# EAGLE design esp32s2Stick (EAGLE 9.6.2)
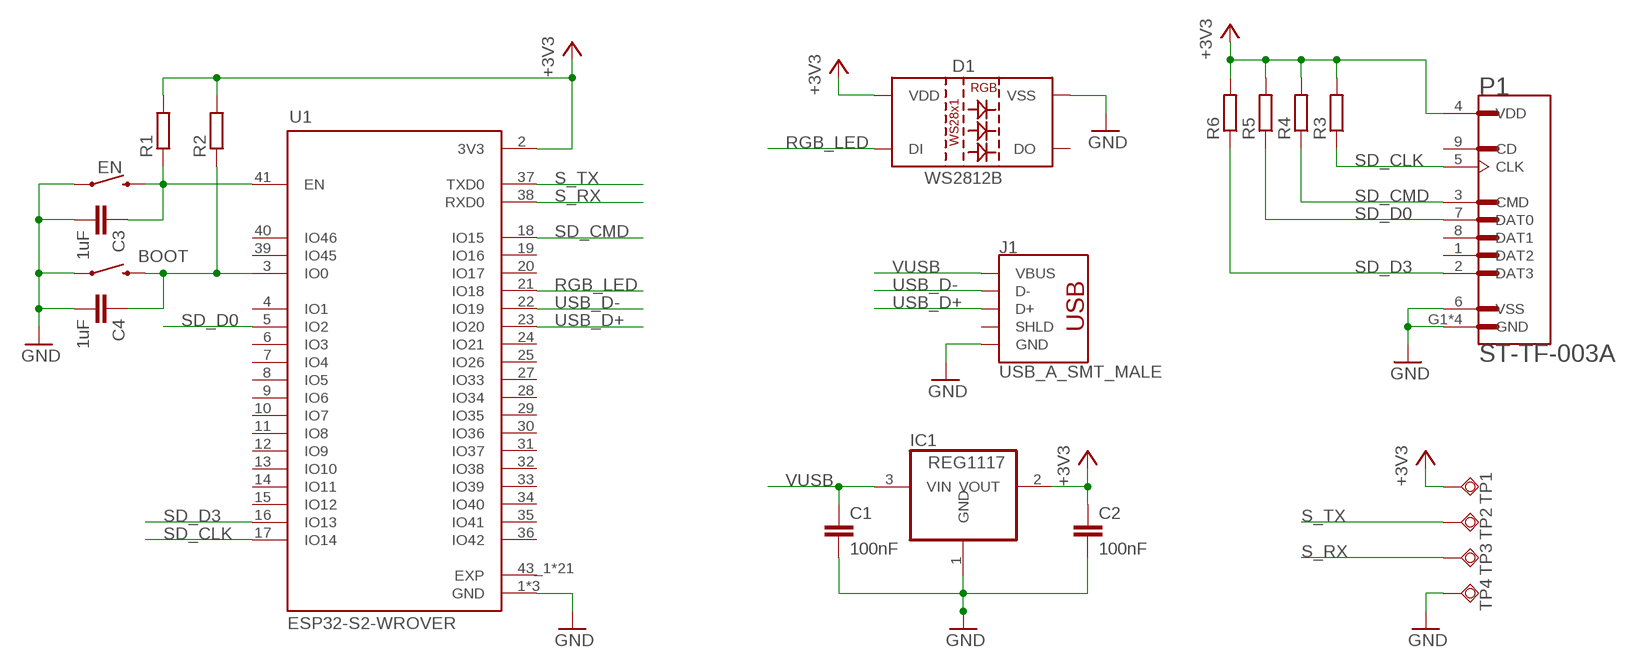
[diagram p0: schematic, sheet 1]

## Parts
BOOT  MOMENTARY-SWITCH-SPST-SMD-5.2MM  [TACTILE_SWITCH_SMD_5.2MM]
C1  100nF  C-EUC0805  [C0805]
C2  100nF  C-EUC0805  [C0805]
C3  1uF  C-EUC0805  [C0805]
C4  1uF  C-EUC0805  [C0805]
D1  WS2812B  [WS2812B]
EN  MOMENTARY-SWITCH-SPST-SMD-5.2MM  [TACTILE_SWITCH_SMD_5.2MM]
IC1  REG1117  [SOT223]
J1  USB_A_SMT_MALE  [USB-A-SMT-MALE]
P1  ST-TF-003A  [SUNTECH_ST-TF-003A]
R1  R-EU_R0603  [R0603]
R2  R-EU_R0603  [R0603]
R3  R-EU_R0603  [R0603]
R4  R-EU_R0603  [R0603]
R5  R-EU_R0603  [R0603]
R6  R-EU_R0603  [R0603]
TP1  TPSQTP15R  [TP15R]
TP2  TPSQTP15R  [TP15R]
TP3  TPSQTP15R  [TP15R]
TP4  TPSQTP15R  [TP15R]
U1  ESP32-S2-WROVER  [MODULE_ESP32-S2-WROVER]

## Nets
+3V3: C2.1 D1.1(VDD) IC1.2(VOUT) P1.4(VDD) R1.2 R2.2 R3.2 R4.2 R5.2 R6.2 TP1.TP U1.2(3V3)
GND: BOOT.1 C1.2 C2.2 C3.2 C4.2 D1.3(VSS) EN.1 IC1.1(GND) J1.GND1(GND) P1.6(VSS) P1.G1(GND) P1.G2(GND) P1.G3(GND) P1.G4(GND) TP4.TP U1.1(GND) U1.26(GND) U1.42(GND)
N$1: BOOT.3 C4.1 R2.1 U1.3(IO0)
N$2: C3.1 EN.3 R1.1 U1.41(EN)
RGB_LED: D1.4(DI) U1.21(IO18)
S_RX: TP3.TP U1.38(RXD0)
S_TX: TP2.TP U1.37(TXD0)
SD_CLK: P1.5(CLK) R3.1 U1.17(IO14)
SD_CMD: P1.3(CMD) R4.1 U1.18(IO15)
SD_D0: P1.7(DAT0) R5.1 U1.5(IO2)
SD_D3: P1.2(DAT3) R6.1 U1.16(IO13)
USB_D+: J1.D+1(D+) U1.23(IO20)
USB_D-: J1.D-1(D-) U1.22(IO19)
VUSB: C1.1 IC1.3(VIN) J1.VBUS1(VBUS)
Unconnected: D1.2(DO) J1.SHLD1(SHLD) J1.SHLD2(SHLD) P1.1(DAT2) P1.8(DAT1) P1.9(CD) U1.4(IO1) U1.6(IO3) U1.7(IO4) U1.8(IO5) U1.9(IO6) U1.10(IO7) U1.11(IO8) U1.12(IO9) U1.13(IO10) U1.14(IO11) U1.15(IO12) U1.19(IO16) U1.20(IO17) U1.24(IO21) U1.25(IO26) U1.27(IO33) U1.28(IO34) U1.29(IO35) U1.30(IO36) U1.31(IO37) U1.32(IO38) U1.33(IO39) U1.34(IO40) U1.35(IO41) U1.36(IO42) U1.39(IO45) U1.40(IO46)

## Power pins joined to a net without a drawn wire
EXP: U1.43_1(EXP) U1.43_2(EXP) U1.43_3(EXP) U1.43_4(EXP) U1.43_5(EXP) U1.43_6(EXP) U1.43_7(EXP) U1.43_8(EXP) U1.43_9(EXP) U1.43_10(EXP) U1.43_11(EXP) U1.43_12(EXP) U1.43_13(EXP) U1.43_14(EXP) U1.43_15(EXP) U1.43_16(EXP) U1.43_17(EXP) U1.43_18(EXP) U1.43_19(EXP) U1.43_20(EXP) U1.43_21(EXP)

## Library data of the parts
BOOT EN = SparkFun-Switches:MOMENTARY-SWITCH-SPST: Momentary Switch (Pushbutton) - SPST Normally-open (NO) SPST momentary switches (buttons, pushbuttons). Variants PTH-12MM - 12mm square, through-hole Momentary Pushbutton Switch - 12mm Square <https://www.sparkfun.com/products/9190> (COM-09190) PTH-6.0MM, PTH-6.0MM-KIT - 6.0mm square, through-hole Mini Pushbutton Switch <https://www.sparkfun.com/products/97> (COM-00097) KIT package intended for soldering kit's - only one side of pads' copper is exposed. PTH-RIGHT-ANGLE-KIT - Right-angle, through-hole Right Angle Tactile Button <https://www.sparkfun.com/products/10791> - Used on SparkFun BigTime Watch Kit <https://www.sparkfun.com/products/11734> SMD-12MM - 12mm square, surface-mount Tactile Button - SMD (12mm) <https://www.sparkfun.com/products/12993> (COM-12993) Used on SparkFun PicoBoard <https://www.sparkfun.com/products/11888> SMD-4.5MM - 4.5mm Square Trackball Switch Used on SparkFun Blackberry Trackballer Breakout <https://www.sparkfun.com/products/13169> SMD-4.6MMX2.8MM - 4.60mm x 2.80mm, surface mount Used on SparkFun SAMD21 Mini Breakout <https://www.sparkfun.com/products/13664> SMD-5.2MM, SMD-5.2-REDUNDANT - 5.2mm square, surface-mount Mini Pushbutton Switch - SMD <https://www.sparkfun.com/products/8720> (COM-08720) Used on Arduino Pro Mini <https://www.sparkfun.com/products/11114> REDUNDANT package connects both switch circuits together SMD-6.0X3.5MM - 6.0 x 3.5mm, surface mount Momentary Reset Switch SMD <https://www.sparkfun.com/products/8229> (COM-08229) SMD-6.2MM-TALL - 6.2mm square, surface mount Tactile Button - SMD (6mm) <https://www.sparkfun.com/products/12992> Used on SparkFun Digital Sandbox <https://www.sparkfun.com/products/12651> SMD-RIGHT-ANGLE - Right-angle, surface mount Used on SparkFun Block for Intel® Edison - Arduino <https://www.sparkfun.com/products/13036>; PROD_ID: SWCH-08247; SF_SKU: COM-08720
C1-C4 = rcl:C-EU: CAPACITOR, European symbol; SPICEPREFIX: C
D1 = SparkFun-LED:WS2812B: WS2812B SMD addressable RGB LED 5x5mm SMD LED with built-in controller IC. Color: Red/Green/Blue mC Rating: RGB: 390, 660, 180 mcd Forward Voltage: RGB: 2.0, 3.0, 3.0 V Packages:WS2812B SparkFun Products: Blynk Board - ESP8266 <https://www.sparkfun.com/products/13794>; PROD_ID: DIO-12503
IC1 = burr-brown:REG1117: 800mA and 1A Low Dropout (LDO) Positive Regulator 1.8V, 2.5V, 2.85V, 3.3V, 5V, and Adj; MPN: REG1117; OC_FARNELL: 1097566; OC_NEWARK: 14P6981
J1 = SparkFun-Connectors:USB_A: USB-A Connector Male and female variants, as well as PTH and SMT variants SparkFun Products: SparkFun XBee Explorer Dongle <https://www.sparkfun.com/products/11697> PTH Male SparkFun MicroView-USB Programmer <https://www.sparkfun.com/products/12924> SMT Male SparkFun USB Type A Female Breakout <https://www.sparkfun.com/products/12700> SMT Female; PROD_ID: CONN-11499
P1 = ST-TF-003A:ST-TF-003A: Micro SD Card Socket; AVAILABILITY: Unavailable; DESCRIPTION: Micro SD Card Socket; MF: Suntech; MP: ST-TF-003A; PACKAGE: None; PRICE: None
R1-R6 = rcl:R-EU_: RESISTOR, European symbol; SPICEPREFIX: R
TP1-TP4 = testpad:TPSQ: Test pad
U1 = ESP32-S2-WROVER:ESP32-S2-WROVER: WiFi 802.11b/g/n Transceiver Module 2.4GHz Antenna Not Included Surface Mount Check prices <https://pricing.snapeda.com/parts/ESP32-S2-WROVER/Espressif%20Systems/view-part?ref=eda>; AVAILABILITY: Bad; DESCRIPTION: WiFi 802.11b/g/n Transceiver Module 2.4GHz Antenna Not Included Surface Mount; MF: Espressif Systems; MP: ESP32-S2-WROVER; PACKAGE: VFQFN-56 Espressif Systems; PRICE: None

## Board
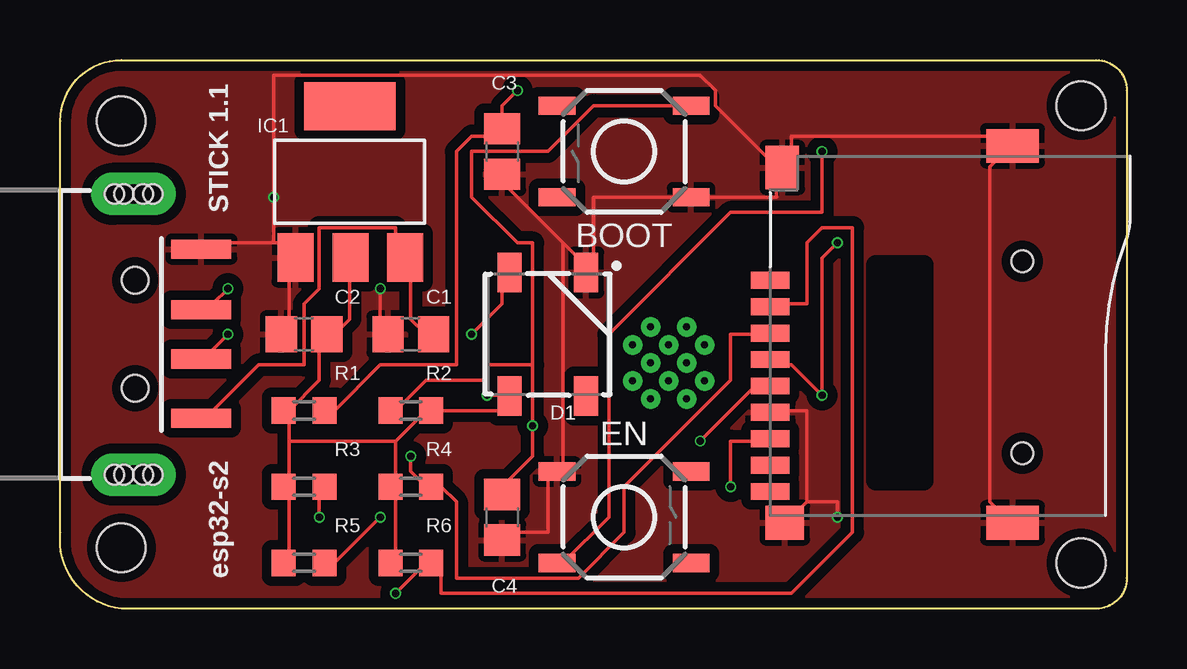
[diagram p1: board, top side]
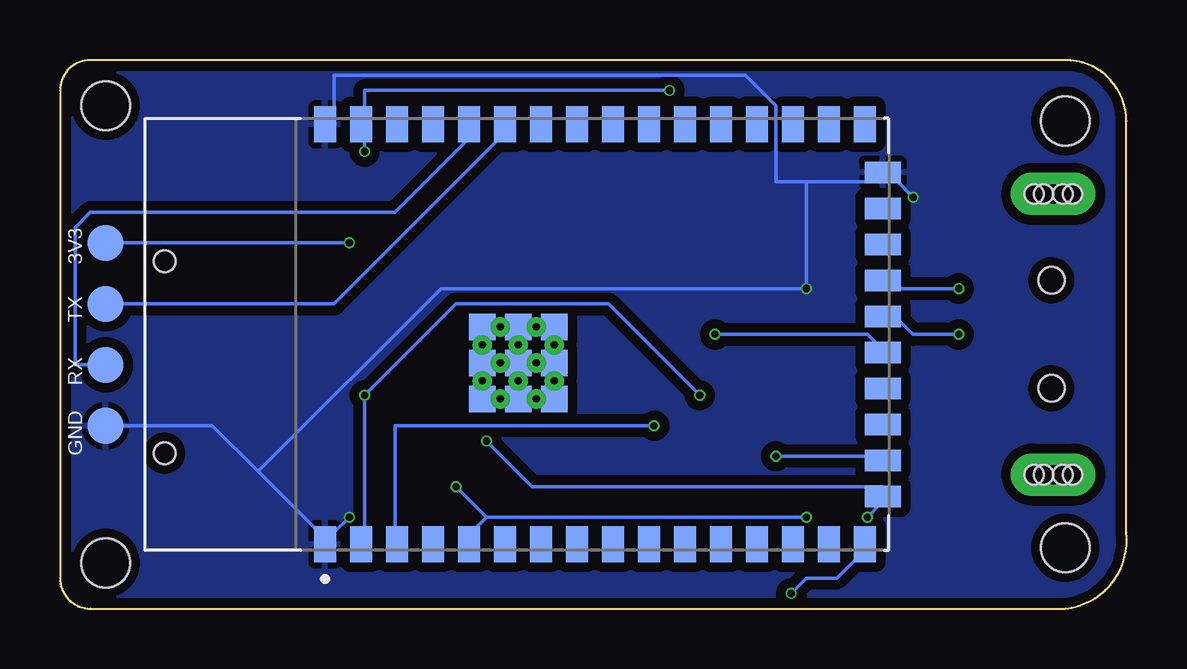
[diagram p2: board, bottom side, seen from below]

Size 44.47 x 22.86 mm. Coordinates in mm from the lower left corner, seen from the top.
Outline: 0.02,20.32 arc-90 2.56,22.86 43.2,22.86 arc-90 44.47,21.59 44.47,1.27 arc-90 43.2,0 2.56,0 arc-90 0.02,3.17 0.02,20.32
Copper layers (1*16): Top 0.035mm / dielectric 1.6mm / Bottom 0.035mm
Design rules "jlcpcb-2layers *": minimum track width 6mil, minimum drill 0.3mm, track to track 6mil, track to pad 6mil, pad to pad 6mil, via to via 6mil, smd to smd 6mil, copper to edge 0.2mm, drill to drill 6mil, minimum pad ring 10mil, minimum via ring 3mil, stop-mask expansion 4mil, vias tented up to drill 0mil, thermal gap 10mil
Holes 2.03 mm at 2.56,20.32 2.56,2.54 42.56,20.95 42.56,1.91

### Footprints (pad centres in the part's own frame; a part is rotated, then mirrored left to right if it is on the bottom)
TACTILE_SWITCH_SMD_5.2MM = smd 1.524 x 0.762: 1 -2.794,1.905; 2 2.794,1.905; 3 -2.794,-1.905; 4 2.794,-1.905
C0805 = smd 1.3 x 1.5: 1 -0.95,0; 2 0.95,0
WS2812B = smd 1.651 x 1: 1 2.577,-1.6; 2 2.577,1.6; 3 -2.577,1.6; 4 -2.577,-1.6
SOT223 = smd 1.499 x 2.007: 1 -2.261,-3.15; 2 0.025,-3.15; 3 2.311,-3.15 | smd 3.81 x 2.007: 4 0,3.15
USB-A-SMT-MALE = smd 2.5 x 0.8: D+1 10.95,1.027; D-1 10.95,-1.027; GND1 10.95,3.551; VBUS1 10.95,-3.5 | drill 0.8 pad 1.778 long: SHLD1 8.13,-5.85; SHLD2 8.13,5.85 | hole 1.1: 8.2,2.25; 8.2,-2.25 | hole 0.8: 8.53,-5.85; 8.93,-5.85; 7.73,-5.85; 7.33,-5.85; 8.53,5.85; 8.93,5.85; 7.73,5.85; 7.33,5.85
SUNTECH_ST-TF-003A = smd 0.7 x 1.6: 1 3.52,5.33; 2 2.42,5.33; 3 1.32,5.33; 4 0.22,5.33; 5 -0.88,5.33; 6 -1.98,5.33; 7 -3.08,5.33; 8 -4.18,5.33; 9 -5.28,5.33 | smd 1.4 x 1.6: G1 -6.58,4.73 | smd 1.4 x 2.2: G2 -6.58,-4.77; G3 9.12,-4.77 | smd 1.8 x 1.4: G4 8.22,4.83 | hole 0.9: -3.68,-5.17; 4.32,-5.17
R0603 = smd 1 x 1.1: 1 -0.85,0; 2 0.85,0
TP15R = smd 1.5 x 1.5: TP 0,0
MODULE_ESP32-S2-WROVER = smd 1.5 x 0.9: 1 -8.75,8; 2 -8.75,6.5; 3 -8.75,5; 4 -8.75,3.5; 5 -8.75,2; 6 -8.75,0.5; 7 -8.75,-1; 8 -8.75,-2.5; 9 -8.75,-4; 10 -8.75,-5.5; 11 -8.75,-7; 12 -8.75,-8.5; 13 -8.75,-10; 14 -8.75,-11.5; 15 -8.75,-13; 16 -8.75,-14.5; 27 8.75,-14.5; 28 8.75,-13; 29 8.75,-11.5; 30 8.75,-10; 31 8.75,-8.5; 32 8.75,-7; 33 8.75,-5.5; 34 8.75,-4; 35 8.75,-2.5; 36 8.75,-1; 37 8.75,0.5; 38 8.75,2; 39 8.75,3.5; 40 8.75,5; 41 8.75,6.5; 42 8.75,8 | smd 0.9 x 1.5: 17 -6.75,-15.25; 18 -5.25,-15.25; 19 -3.75,-15.25; 20 -2.25,-15.25; 21 -0.75,-15.25; 22 0.75,-15.25; 23 2.25,-15.25; 24 3.75,-15.25; 25 5.25,-15.25; 26 6.75,-15.25 | smd 1.1 x 1.1: 43_1 -2.69,1.45; 43_2 -1.19,1.45; 43_3 0.31,1.45; 43_4 -2.69,-0.05; 43_5 -1.19,-0.05; 43_6 0.31,-0.05; 43_7 -2.69,-1.55; 43_8 -1.19,-1.55; 43_9 0.31,-1.55 | drill 0.3 pad 0.406: 43_10 -1.94,1.45; 43_11 -0.44,1.45; 43_12 -2.69,0.7; 43_13 -1.19,0.7; 43_14 0.31,0.7; 43_15 -1.94,-0.05; 43_16 -0.44,-0.05; 43_17 -2.69,-0.8; 43_18 -1.19,-0.8; 43_19 0.31,-0.8; 43_20 -1.94,-1.55; 43_21 -0.44,-1.55

### Placement (x,y rotation side)
BOOT  23.51,19.05 180 top
C1  14.62,11.43 180 top
C2  10.18,11.43 180 top
C3  18.43,19.05 270 top
C4  18.43,3.81 270 top
D1  20.34,11.43 270 top
EN  23.51,3.81 0 top
IC1  12.08,17.78 0 top
J1  -5.06,11.43 0 top
P1  34.94,10.16 90 top
R1  10.18,8.26 180 top
R2  14.62,8.26 0 top
R3  10.18,5.08 180 top
R4  14.62,5.08 180 top
R5  10.18,1.91 180 top
R6  14.62,1.91 180 top
TP1  42.56,15.24 0 bottom
TP2  42.56,12.7 0 bottom
TP3  42.56,10.16 0 bottom
TP4  42.56,7.62 0 bottom
U1  25.42,11.43 90 bottom

### Tracks (layer width: path | path; a pad name or v marks a point on that pad's centre or on a via)
+3V3  (via drill 0.3)
  Top 0.152: 13.99,5.08 13.99,1.91 R6.2 | 13.99,6.99 13.99,5.08 | 13.99,6.99 15.26,8.26 R2.2 18.43,8.26 D1.1 18.43,8.89 v17.8,8.89 | 13.99,5.08 R4.2 | IC1.2 12.08,14.61 12.08,12.06 11.45,11.43 C2.1 10.81,11.43 10.81,9.53 9.54,8.26 | 9.54,5.08 9.54,1.91 R5.2 | 9.54,5.08 9.54,6.99 | 9.54,6.99 9.54,8.26 | 9.54,5.08 R3.2 | 9.54,8.26 R1.2 | 9.54,6.99 13.99,6.99 | P1.4 29.86,10.16 30.5,10.16 v31.77,8.89 31.77,14.61 v32.4,15.24
  Bottom 0.152: U1.2 31.77,3.17 v31.77,8.89 27.96,12.7 21.61,12.7 v17.8,8.89 | v32.4,15.24 TP1.TP
EXP
  Bottom 0.152: 24.78,12.06 24.15,12.06 U1.43_9 | 24.78,12.06 25.42,12.06 U1.43_6 25.42,11.43 25.42,10.79 | 24.78,12.06 U1.43_19 | U1.43_14 26.05,12.06 26.69,12.06 U1.43_3 26.69,11.43 26.69,10.79 | 26.69,10.16 26.05,10.16 U1.43_13 | 26.69,10.16 26.69,9.53 | 25.42,10.16 24.78,10.16 U1.43_18 | 25.42,10.16 25.42,9.53 | 26.05,8.89 26.69,8.89 | 24.78,8.89 25.42,8.89 | 24.15,9.53 24.15,8.89 | 24.15,10.16 24.15,10.79 U1.43_21 | 24.15,10.16 24.15,9.53 | 24.15,9.53 U1.43_20 | 24.15,10.16 U1.43_8 | 24.15,8.89 24.78,8.89 | 24.78,8.89 U1.43_17 | 24.15,8.89 U1.43_7 | 25.42,8.89 26.05,8.89 | 26.05,8.89 U1.43_12 | 25.42,8.89 25.42,9.53 | 25.42,9.53 U1.43_15 | 25.42,8.89 U1.43_4 | 26.69,8.89 26.69,9.53 | 26.69,9.53 U1.43_10 | 26.69,8.89 U1.43_1 | 26.69,10.16 26.69,10.79 | 26.69,10.79 U1.43_11 | 26.69,10.16 U1.43_2 | 25.42,10.16 25.42,10.79 | 25.42,10.79 U1.43_16 | 25.42,10.16 U1.43_5
GND  (via drill 0.3)
  Top 0.152: P1.G2 39.39,3.81 38.75,4.45 38.75,18.41 39.39,19.05 P1.G3 39.39,19.68 30.5,19.68 30.5,18.41 P1.G4 | P1.G4 29.86,17.78 29.86,17.14 BOOT.1 22.24,17.14 22.24,14.61 D1.3 21.61,14.61 20.97,15.24 | C4.2 18.43,3.17 20.34,3.17 20.34,5.71 EN.1 20.97,5.71 20.97,15.24 | 20.97,15.24 18.43,17.78 C3.2 | 31.13,4.45 31.13,8.26 29.86,8.26 P1.6 | 31.13,4.45 30.5,3.81 P1.G1 | 31.13,4.45 32.4,4.45 v32.4,3.81 | C2.2 9.54,11.43 9.54,14.61 IC1.1 9.54,15.24 8.91,15.24 | 8.91,15.24 6.37,15.24 J1.GND1 | v13.35,13.34 13.35,11.43 C1.2 | 8.91,15.24 v8.91,17.14 8.91,22.23 26.69,22.23 27.32,21.59 27.32,20.95 29.86,18.41 P1.G4
  Bottom 0.152: 36.21,5.71 38.12,7.62 TP4.TP | 36.21,5.71 33.67,3.17 U1.1 33.04,3.17 v32.4,3.81 | 13.35,17.78 v13.35,13.34 28.59,13.34 36.21,5.71 | 13.35,17.78 10.18,17.78 U1.26 9.54,17.78 v8.91,17.14 | 13.35,17.78 14.62,17.78 14.62,20.95 15.89,22.23 33.04,22.23 33.04,20.32 U1.42
  pour Top (isolate 0.406): 0.02,22.86 44.47,22.86 44.47,0 0.02,0
  pour Bottom (isolate 0.406): 0.02,22.86 44.47,22.86 44.47,0 0.02,0
N$1  (via drill 0.3)
  Top 0.152: 19.7,10.16 17.8,10.16 17.8,9.53 15.26,9.53 13.99,8.26 R2.1 | 19.7,10.16 v19.7,7.62 19.7,6.35 18.43,5.08 C4.1 | BOOT.3 22.24,20.95 20.34,19.05 17.16,19.05 17.16,17.14 19.07,15.24 19.7,15.24 19.7,10.16
  Bottom 0.152: v19.7,7.62 30.5,7.62 30.5,3.17 U1.3
N$2  (via drill 0.3)
  Top 0.152: R1.1 11.45,8.26 13.35,10.16 16.53,10.16 16.53,19.05 17.16,19.68 18.43,19.68 C3.1 18.43,20.95 v19.07,21.59 | v31.77,19.05 31.77,16.51 27.96,16.51 22.88,11.43 22.88,3.81 20.97,1.91 EN.3
  Bottom 0.152: v19.07,21.59 31.77,21.59 31.77,20.32 U1.41 31.77,19.68 v31.77,19.05
RGB_LED  (via drill 0.3)
  Top 0.152: v17.16,11.43 18.43,12.7 18.43,13.97 D1.4
  Bottom 0.152: v17.16,11.43 10.81,11.43 10.18,10.79 U1.21
S_RX
  Bottom 0.152: TP3.TP 43.83,10.16 43.83,15.88 43.2,16.51 30.5,16.51 27.32,19.68 U1.38
S_TX
  Bottom 0.152: TP2.TP 33.04,12.7 26.05,19.68 U1.37
SD_CLK  (via drill 0.3)
  Top 0.152: v10.81,3.81 10.81,5.08 R3.1 | v26.69,6.99 29.23,9.53 P1.5
  Bottom 0.152: v10.81,3.81 10.18,4.45 U1.17 10.18,5.08 24.78,5.08 v26.69,6.99
SD_CMD  (via drill 0.3)
  Top 0.152: v14.62,6.35 14.62,5.71 15.26,5.08 R4.1 15.89,5.08 16.53,4.45 16.53,1.27 21.61,1.27 23.51,3.17 23.51,5.08 27.96,9.53 27.96,11.43 29.23,11.43 P1.3
  Bottom 0.152: v14.62,6.35 10.18,6.35 U1.18
SD_D0  (via drill 0.3)
  Top 0.152: v13.35,3.81 11.45,1.91 R5.1 | v27.96,5.08 27.96,6.99 29.23,6.99 P1.7
  Bottom 0.152: 26.69,3.81 v13.35,3.81 | 26.69,3.81 27.32,3.17 U1.5 | 26.69,3.81 v27.96,5.08
SD_D3  (via drill 0.3)
  Top 0.152: v13.99,0.64 15.26,1.91 R6.1 15.89,1.91 15.89,0.64 30.5,0.64 33.04,3.17 33.04,15.88 31.77,15.88 31.13,15.24 31.13,12.7 29.86,12.7 P1.2
  Bottom 0.152: v13.99,0.64 13.35,1.27 12.08,1.27 10.81,2.54 U1.16
USB_D+  (via drill 0.3)
  Top 0.152: v7,13.34 6.37,12.7 J1.D+1
  Bottom 0.152: v7,13.34 9.54,13.34 U1.23
USB_D-  (via drill 0.3)
  Top 0.152: v7,11.43 6.37,10.79 J1.D-1
  Bottom 0.152: v7,11.43 8.91,11.43 9.54,12.06 U1.22
VUSB
  Top 0.152: C1.1 15.26,11.43 14.62,12.06 14.62,14.61 IC1.3 13.99,15.24 13.99,15.88 10.81,15.88 10.81,13.34 10.18,12.7 10.18,10.16 8.27,10.16 6.37,8.26 J1.VBUS1

### Text on the board
tNames: STICK 1.1 | esp32-s2
bNames: 3V3 | TX | RX | GND